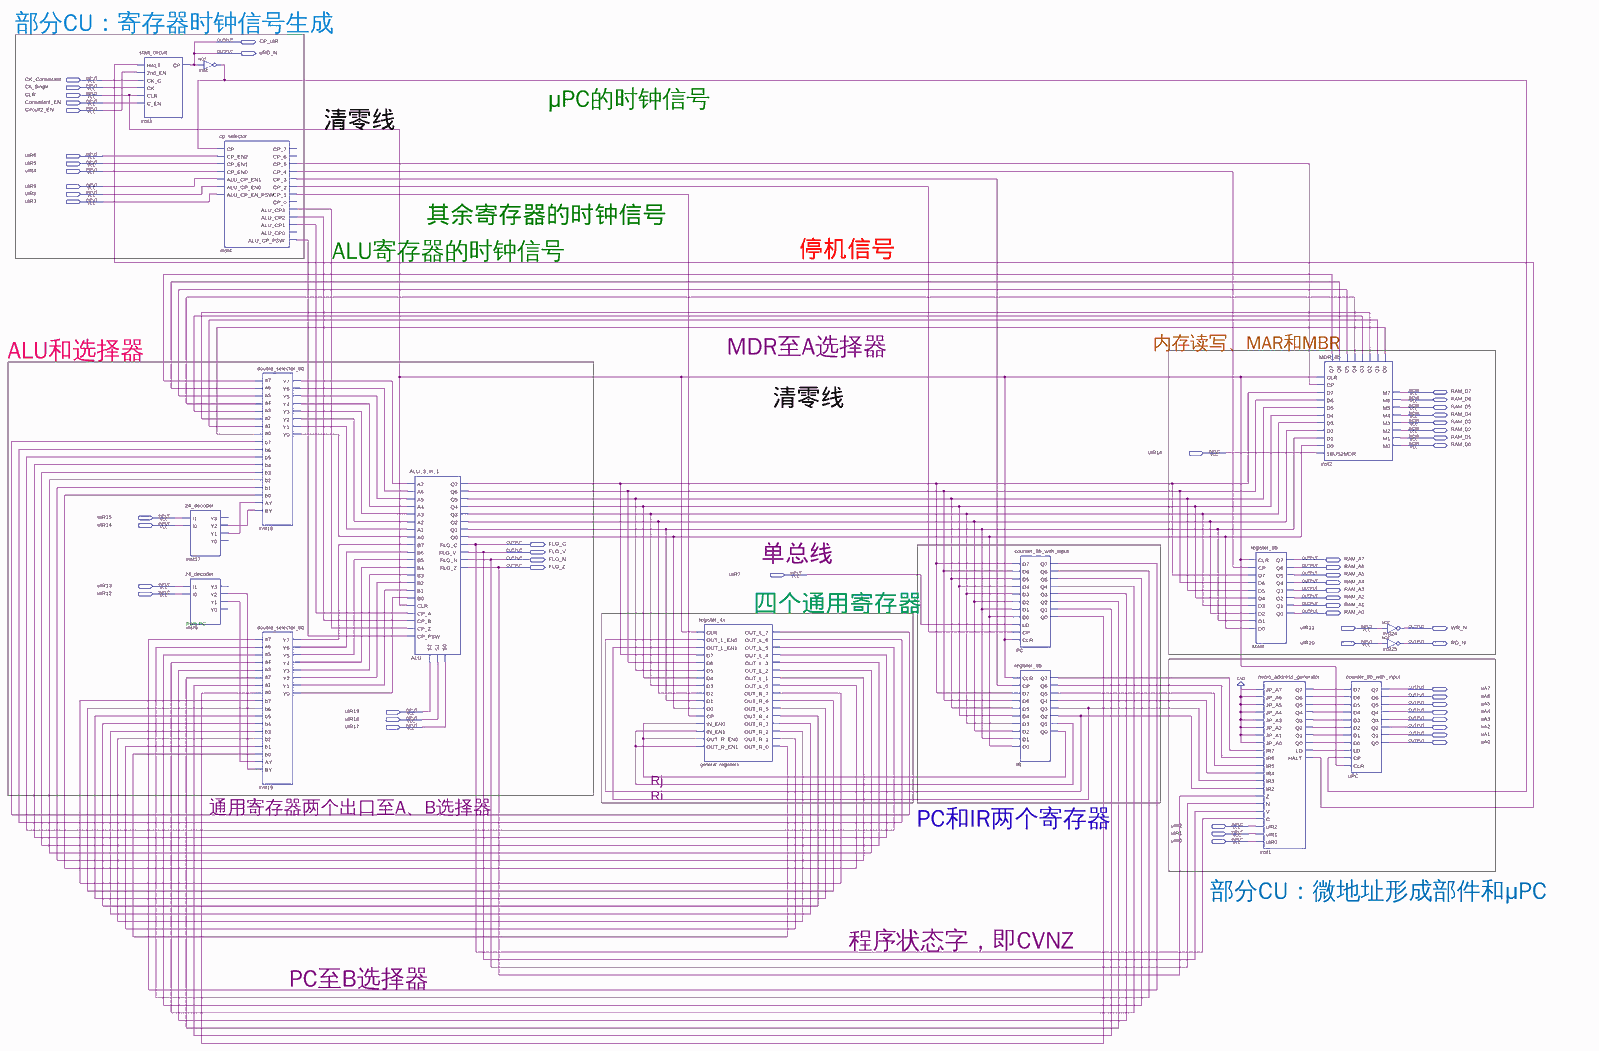
[diagram p0: schematic sheet, whole]
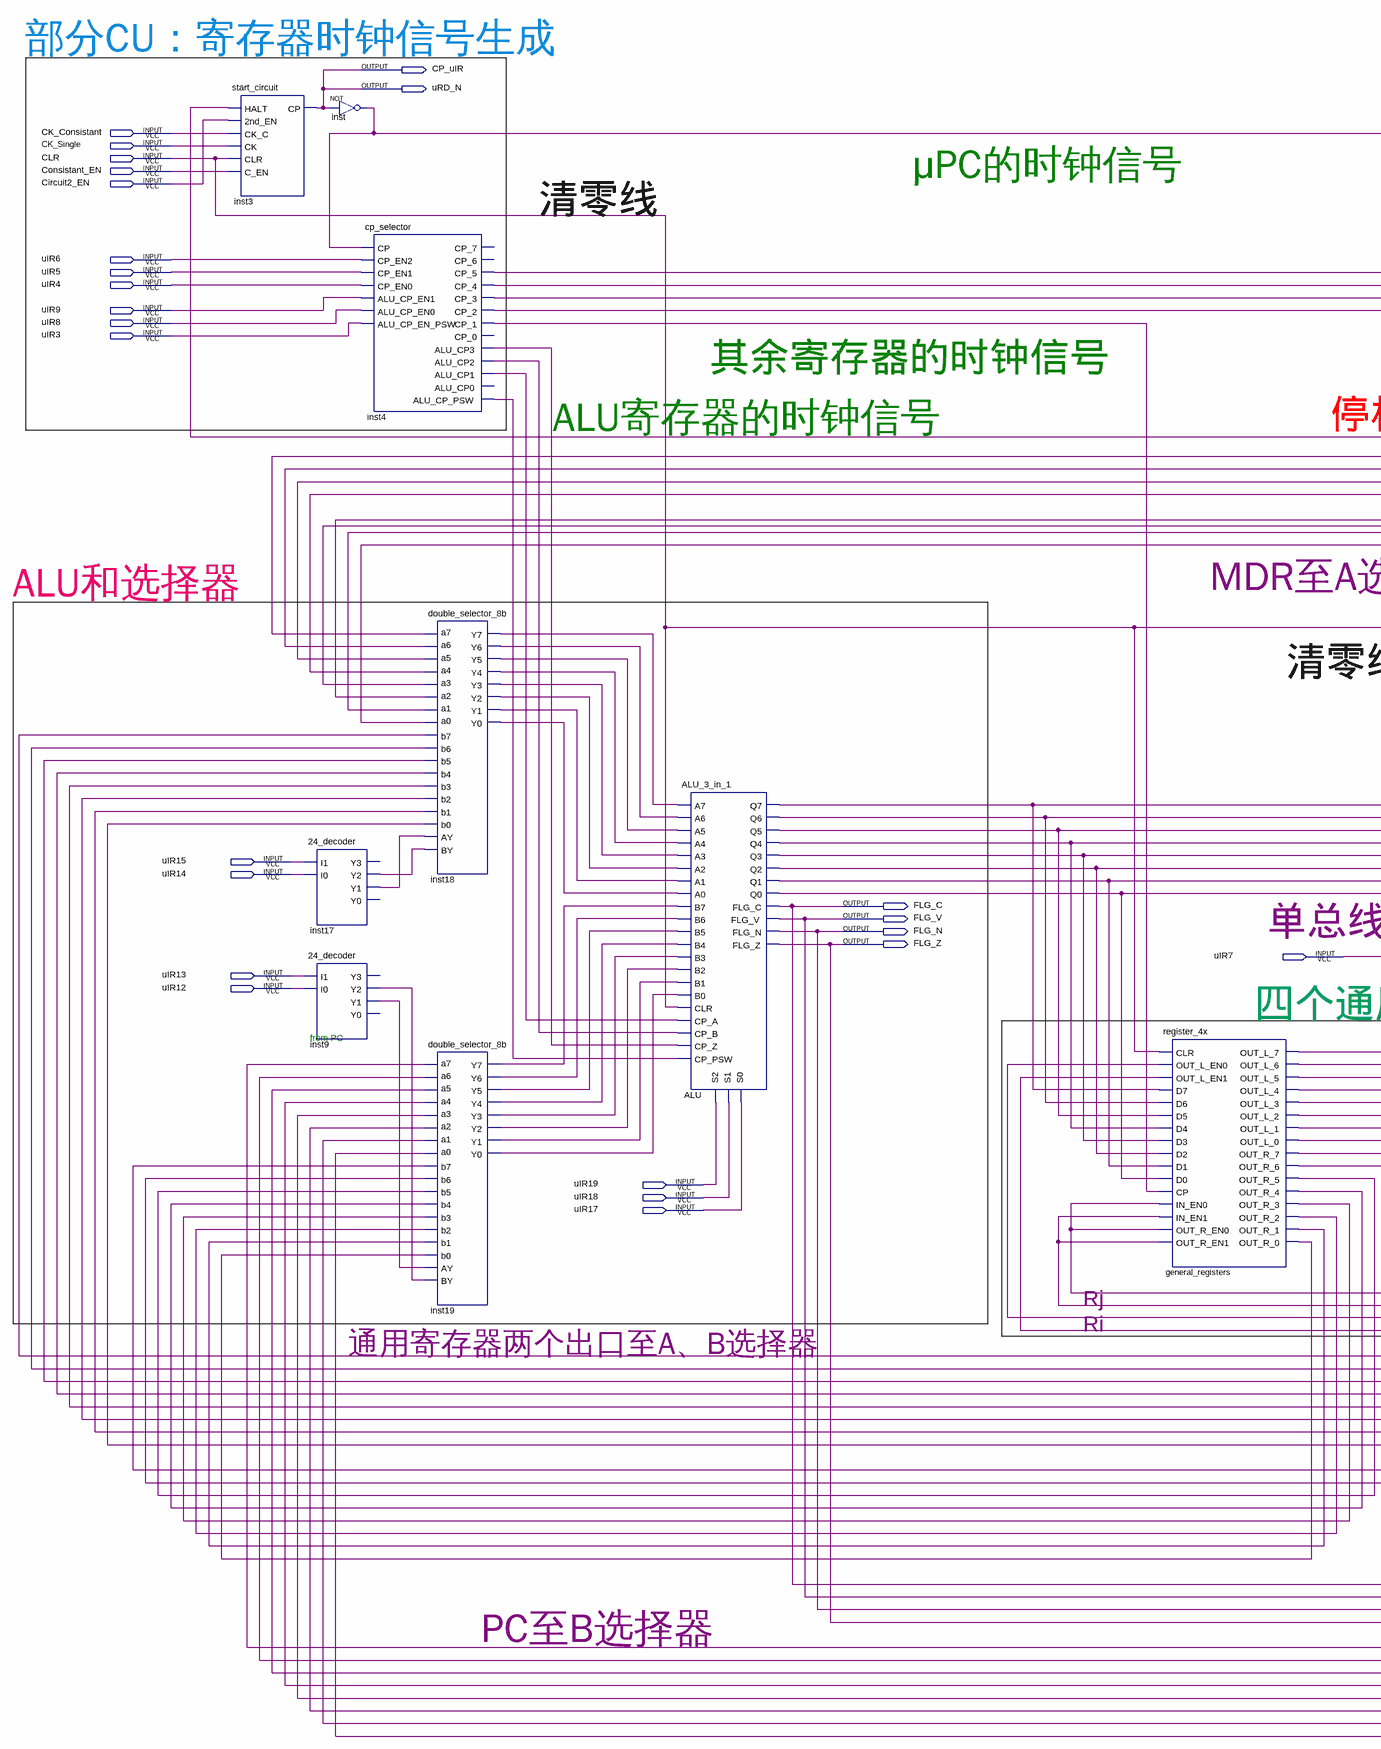
[diagram p1: schematic sheet, left part]
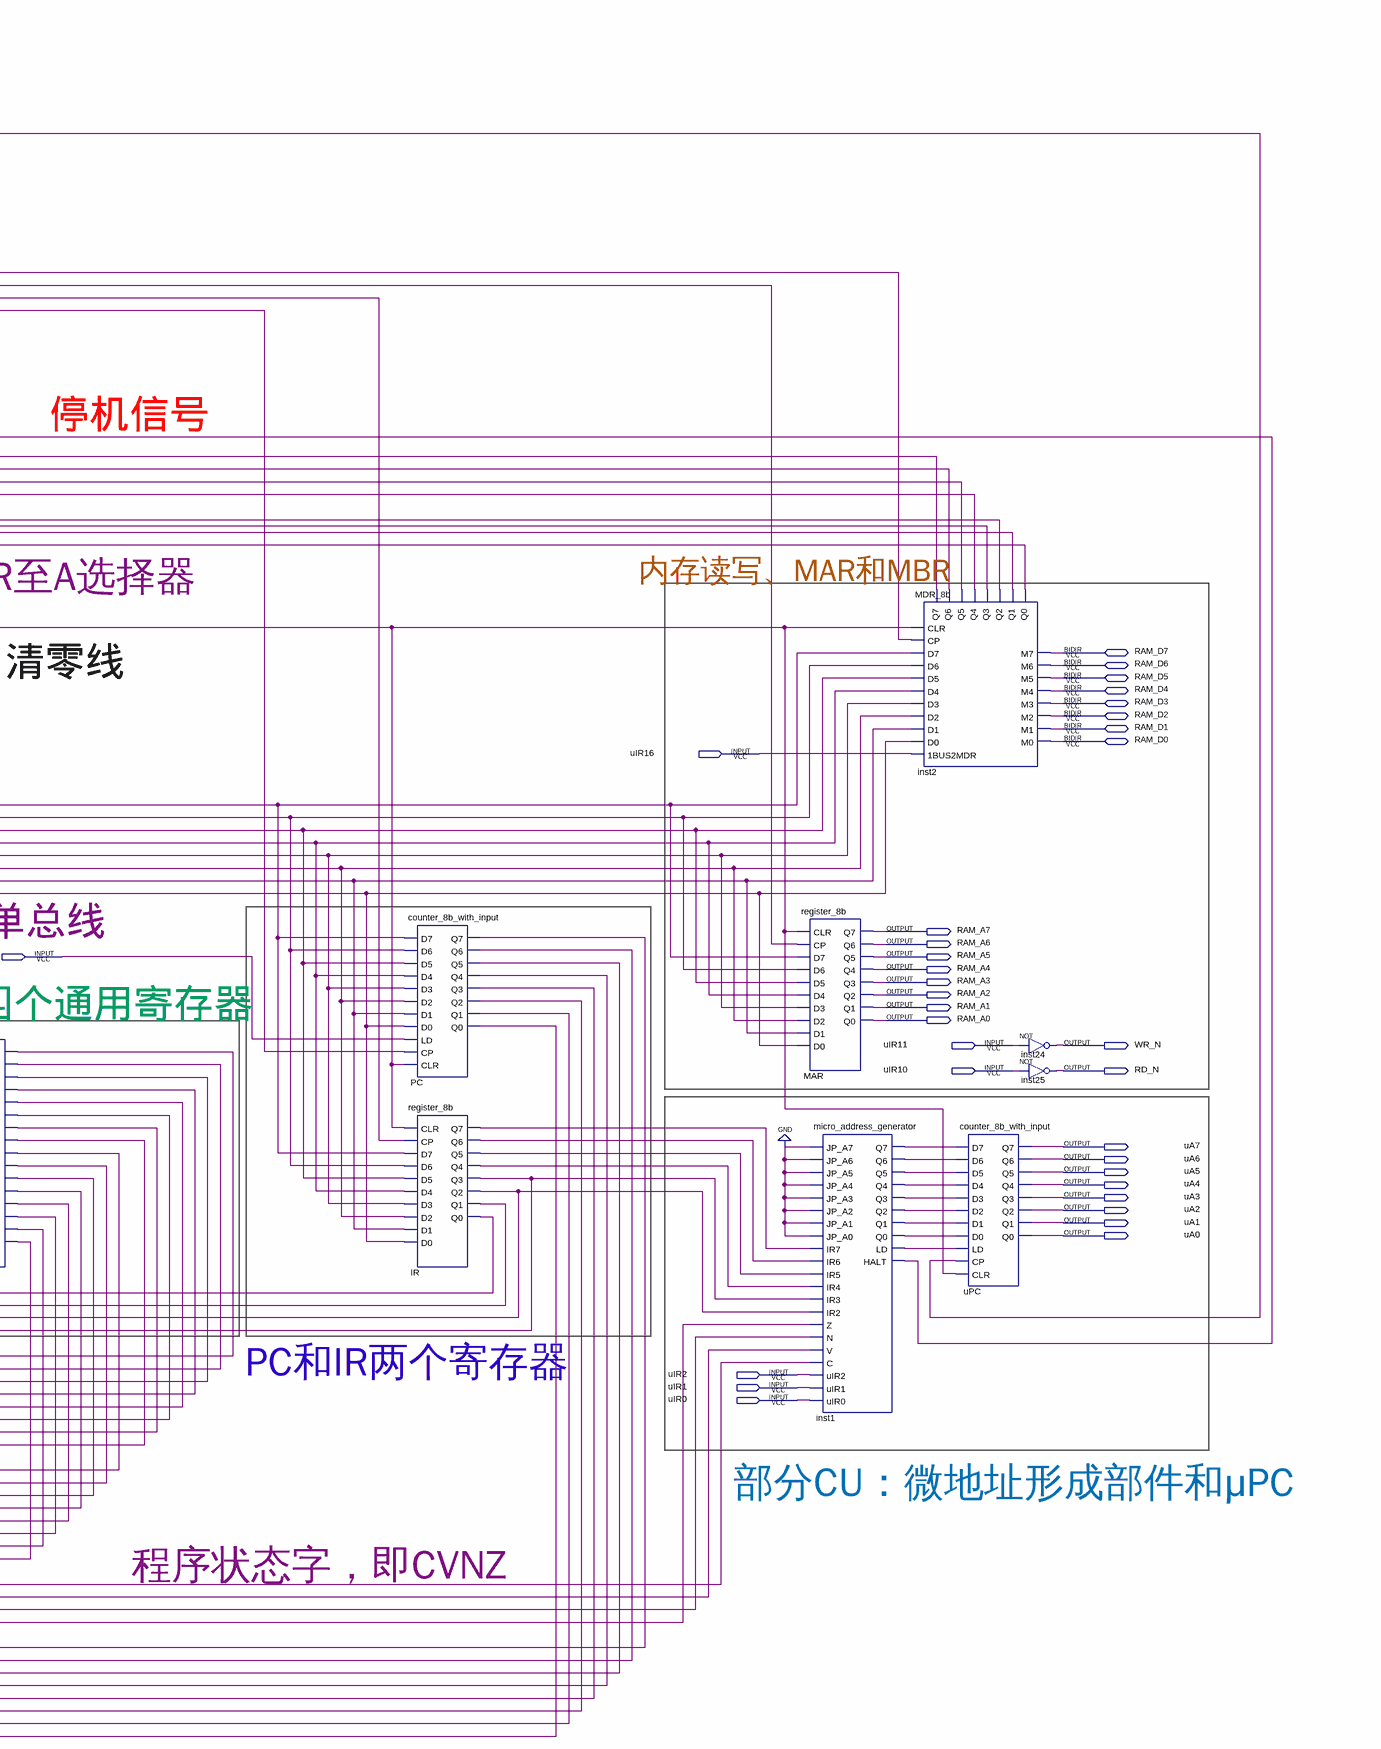
[diagram p2: schematic sheet, right part]
// Quartus schematic machine_alpha.bdf as structural Verilog: 17 symbols, 57 pins
module machine_alpha (
  input  CK_Consistant,
  input  CK_Single,
  input  CLR,
  input  Consistant_EN,
  input  Circuit2_EN,
  input  uIR6,
  input  uIR5,
  input  uIR4,
  input  uIR9,
  input  uIR8,
  input  uIR3,
  input  uIR16,
  input  uIR15,
  input  uIR14,
  input  uIR7,
  input  uIR13,
  input  uIR12,
  input  uIR11,
  input  uIR10,
  input  uIR19,
  input  uIR18,
  input  uIR17,
  input  uIR2,
  input  uIR1,
  input  uIR0,
  inout  RAM_D7,
  inout  RAM_D6,
  inout  RAM_D5,
  inout  RAM_D4,
  inout  RAM_D3,
  inout  RAM_D2,
  inout  RAM_D1,
  inout  RAM_D0,
  output CP_uIR,
  output uRD_N,
  output FLG_C,
  output FLG_V,
  output FLG_N,
  output RAM_A7,
  output FLG_Z,
  output RAM_A6,
  output RAM_A5,
  output RAM_A4,
  output RAM_A3,
  output RAM_A2,
  output RAM_A1,
  output RAM_A0,
  output WR_N,
  output RD_N,
  output uA7,
  output uA6,
  output uA5,
  output uA4,
  output uA3,
  output uA2,
  output uA1,
  output uA0
);

  wire ALU_q0, ALU_q1, ALU_q2, ALU_q3, ALU_q4, ALU_q5, ALU_q6, ALU_q7, general_registers_out_l_0,
       general_registers_out_l_1, general_registers_out_l_2, general_registers_out_l_3,
       general_registers_out_l_4, general_registers_out_l_5, general_registers_out_l_6,
       general_registers_out_l_7, general_registers_out_r_0, general_registers_out_r_1,
       general_registers_out_r_2, general_registers_out_r_3, general_registers_out_r_4,
       general_registers_out_r_5, general_registers_out_r_6, general_registers_out_r_7, inst1_halt, inst1_ld,
       inst1_q0, inst1_q1, inst1_q2, inst1_q3, inst1_q4, inst1_q5, inst1_q6, inst1_q7, inst2_q0, inst2_q1,
       inst2_q2, inst2_q3, inst2_q4, inst2_q5, inst2_q6, inst2_q7, inst4_alu_cp1, inst4_alu_cp2,
       inst4_alu_cp3, inst4_alu_cp_psw, inst4_cp_1, inst4_cp_2, inst4_cp_3, inst4_cp_4, inst4_cp_5, inst9_y1,
       inst9_y2, inst17_y1, inst17_y2, inst18_y0, inst18_y1, inst18_y2, inst18_y3, inst18_y4, inst18_y5,
       inst18_y6, inst18_y7, inst19_y0, inst19_y1, inst19_y2, inst19_y3, inst19_y4, inst19_y5, inst19_y6,
       inst19_y7, inst_out, IR_q0, IR_q1, IR_q2, IR_q3, IR_q4, IR_q5, IR_q6, IR_q7, PC_q0, PC_q1, PC_q2,
       PC_q3, PC_q4, PC_q5, PC_q6, PC_q7;

  start_circuit inst3 (
    .HALT(inst1_halt), .\2nd_EN (Circuit2_EN), .CK_C(CK_Consistant), .CK(CK_Single), .CLR(CLR),
    .C_EN(Consistant_EN), .CP(CP_uIR));
  not inst (inst_out, CP_uIR);
  \24_decoder  inst17 (.I1(uIR15), .I0(uIR14), .Y2(inst17_y2), .Y1(inst17_y1));  // open: Y3, Y0
  \24_decoder  inst9 (.I1(uIR13), .I0(uIR12), .Y2(inst9_y2), .Y1(inst9_y1));  // open: Y3, Y0
  cp_selector inst4 (
    .CP(inst_out), .CP_EN2(uIR6), .CP_EN1(uIR5), .CP_EN0(uIR4), .ALU_CP_EN1(uIR9), .ALU_CP_EN0(uIR8),
    .ALU_CP_EN_PSW(uIR3), .CP_5(inst4_cp_5), .CP_4(inst4_cp_4), .CP_3(inst4_cp_3), .CP_2(inst4_cp_2),
    .CP_1(inst4_cp_1), .ALU_CP3(inst4_alu_cp3), .ALU_CP2(inst4_alu_cp2), .ALU_CP1(inst4_alu_cp1),
    .ALU_CP_PSW(inst4_alu_cp_psw));  // open: CP_7, CP_6, CP_0, ALU_CP0
  double_selector_8b inst18 (
    .a0(inst2_q0), .a1(inst2_q1), .a2(inst2_q2), .a3(inst2_q3), .a4(inst2_q4), .a5(inst2_q5), .a6(inst2_q6),
    .a7(inst2_q7), .b0(general_registers_out_l_0), .b1(general_registers_out_l_1),
    .b2(general_registers_out_l_2), .b3(general_registers_out_l_3), .b4(general_registers_out_l_4),
    .b5(general_registers_out_l_5), .b6(general_registers_out_l_6), .b7(general_registers_out_l_7),
    .AY(inst17_y1), .BY(inst17_y2), .Y0(inst18_y0), .Y1(inst18_y1), .Y2(inst18_y2), .Y3(inst18_y3),
    .Y4(inst18_y4), .Y5(inst18_y5), .Y6(inst18_y6), .Y7(inst18_y7));
  double_selector_8b inst19 (
    .a0(PC_q0), .a1(PC_q1), .a2(PC_q2), .a3(PC_q3), .a4(PC_q4), .a5(PC_q5), .a6(PC_q6), .a7(PC_q7),
    .b0(general_registers_out_r_0), .b1(general_registers_out_r_1), .b2(general_registers_out_r_2),
    .b3(general_registers_out_r_3), .b4(general_registers_out_r_4), .b5(general_registers_out_r_5),
    .b6(general_registers_out_r_6), .b7(general_registers_out_r_7), .AY(inst9_y1), .BY(inst9_y2),
    .Y0(inst19_y0), .Y1(inst19_y1), .Y2(inst19_y2), .Y3(inst19_y3), .Y4(inst19_y4), .Y5(inst19_y5),
    .Y6(inst19_y6), .Y7(inst19_y7));
  ALU_3_in_1 ALU (
    .A0(inst18_y0), .A1(inst18_y1), .A2(inst18_y2), .A3(inst18_y3), .A4(inst18_y4), .A5(inst18_y5),
    .A6(inst18_y6), .A7(inst18_y7), .B0(inst19_y0), .B1(inst19_y1), .B2(inst19_y2), .B3(inst19_y3),
    .B4(inst19_y4), .B5(inst19_y5), .B6(inst19_y6), .B7(inst19_y7), .CLR(CLR), .CP_A(inst4_alu_cp1),
    .CP_B(inst4_alu_cp2), .CP_Z(inst4_alu_cp3), .CP_PSW(inst4_alu_cp_psw), .S1(uIR18), .S0(uIR17),
    .S2(uIR19), .Q0(ALU_q0), .Q1(ALU_q1), .Q2(ALU_q2), .Q3(ALU_q3), .Q4(ALU_q4), .Q5(ALU_q5), .Q6(ALU_q6),
    .Q7(ALU_q7), .FLG_V(FLG_V), .FLG_N(FLG_N), .FLG_Z(FLG_Z), .FLG_C(FLG_C));
  register_4x general_registers (
    .CLR(CLR), .OUT_L_EN0(IR_q2), .OUT_L_EN1(IR_q3), .IN_EN1(IR_q1), .IN_EN0(IR_q0), .D7(ALU_q7),
    .D6(ALU_q6), .D5(ALU_q5), .D4(ALU_q4), .D3(ALU_q3), .D2(ALU_q2), .D1(ALU_q1), .D0(ALU_q0),
    .CP(inst4_cp_1), .OUT_R_EN0(IR_q0), .OUT_R_EN1(IR_q1), .OUT_L_7(general_registers_out_l_7),
    .OUT_L_6(general_registers_out_l_6), .OUT_L_5(general_registers_out_l_5),
    .OUT_L_4(general_registers_out_l_4), .OUT_L_3(general_registers_out_l_3),
    .OUT_L_2(general_registers_out_l_2), .OUT_L_1(general_registers_out_l_1),
    .OUT_L_0(general_registers_out_l_0), .OUT_R_7(general_registers_out_r_7),
    .OUT_R_6(general_registers_out_r_6), .OUT_R_5(general_registers_out_r_5),
    .OUT_R_4(general_registers_out_r_4), .OUT_R_3(general_registers_out_r_3),
    .OUT_R_2(general_registers_out_r_2), .OUT_R_1(general_registers_out_r_1),
    .OUT_R_0(general_registers_out_r_0));
  counter_8b_with_input PC (
    .D7(ALU_q7), .D6(ALU_q6), .D5(ALU_q5), .D4(ALU_q4), .D3(ALU_q3), .D2(ALU_q2), .D1(ALU_q1), .D0(ALU_q0),
    .LD(uIR7), .CP(inst4_cp_2), .CLR(CLR), .Q7(PC_q7), .Q6(PC_q6), .Q5(PC_q5), .Q4(PC_q4), .Q3(PC_q3),
    .Q2(PC_q2), .Q1(PC_q1), .Q0(PC_q0));
  register_8b IR (
    .CLR(CLR), .CP(inst4_cp_3), .D7(ALU_q7), .D6(ALU_q6), .D5(ALU_q5), .D4(ALU_q4), .D3(ALU_q3), .D2(ALU_q2),
    .D1(ALU_q1), .D0(ALU_q0), .Q7(IR_q7), .Q6(IR_q6), .Q5(IR_q5), .Q4(IR_q4), .Q3(IR_q3), .Q2(IR_q2),
    .Q1(IR_q1), .Q0(IR_q0));
  register_8b MAR (
    .CLR(CLR), .CP(inst4_cp_4), .D7(ALU_q7), .D6(ALU_q6), .D5(ALU_q5), .D4(ALU_q4), .D3(ALU_q3), .D2(ALU_q2),
    .D1(ALU_q1), .D0(ALU_q0), .Q7(RAM_A7), .Q6(RAM_A6), .Q5(RAM_A5), .Q4(RAM_A4), .Q3(RAM_A3), .Q2(RAM_A2),
    .Q1(RAM_A1), .Q0(RAM_A0));
  micro_address_generator inst1 (
    .JP_A7(1'b0), .JP_A6(1'b0), .JP_A5(1'b0), .JP_A4(1'b0), .JP_A3(1'b0), .JP_A2(1'b0), .JP_A1(1'b0),
    .JP_A0(1'b0), .IR7(IR_q7), .IR6(IR_q6), .IR5(IR_q5), .IR4(IR_q4), .IR3(IR_q3), .IR2(IR_q2), .Z(FLG_Z),
    .N(FLG_N), .V(FLG_V), .C(FLG_C), .uIR2(uIR2), .uIR1(uIR1), .uIR0(uIR0), .Q7(inst1_q7), .Q6(inst1_q6),
    .Q5(inst1_q5), .Q4(inst1_q4), .Q3(inst1_q3), .Q2(inst1_q2), .Q1(inst1_q1), .Q0(inst1_q0), .LD(inst1_ld),
    .HALT(inst1_halt));
  MDR_8b inst2 (
    .CLR(CLR), .CP(inst4_cp_5), .D7(ALU_q7), .D6(ALU_q6), .D5(ALU_q5), .D4(ALU_q4), .D3(ALU_q3), .D2(ALU_q2),
    .D1(ALU_q1), .D0(ALU_q0), .\1BUS2MDR (uIR16), .Q7(inst2_q7), .Q6(inst2_q6), .Q5(inst2_q5), .Q4(inst2_q4),
    .Q3(inst2_q3), .Q2(inst2_q2), .Q1(inst2_q1), .Q0(inst2_q0), .M7(RAM_D7), .M6(RAM_D6), .M5(RAM_D5),
    .M4(RAM_D4), .M3(RAM_D3), .M2(RAM_D2), .M1(RAM_D1), .M0(RAM_D0));
  counter_8b_with_input uPC (
    .D7(inst1_q7), .D6(inst1_q6), .D5(inst1_q5), .D4(inst1_q4), .D3(inst1_q3), .D2(inst1_q2), .D1(inst1_q1),
    .D0(inst1_q0), .LD(inst1_ld), .CP(inst_out), .CLR(CLR), .Q7(uA7), .Q6(uA6), .Q5(uA5), .Q4(uA4), .Q3(uA3),
    .Q2(uA2), .Q1(uA1), .Q0(uA0));
  not inst24 (WR_N, uIR11);
  not inst25 (RD_N, uIR10);

  assign uRD_N = CP_uIR;

  // Notes on the sheet:
  //   部分CU：寄存器时钟信号生成
  //   μPC的时钟信号
  //   清零线
  //   其余寄存器的时钟信号
  //   停机信号
  //   ALU寄存器的时钟信号
  //   MDR至A选择器
  //   内存读写、MAR和MBR
  //   ALU和选择器
  //   清零线
  //   单总线
  //   四个通用寄存器
  //   from PC
  //   Rj
  //   Ri
  //   通用寄存器两个出口至A、B选择器
  //   PC和IR两个寄存器
  //   部分CU：微地址形成部件和μPC
  //   程序状态字，即CVNZ
  //   PC至B选择器
endmodule
